# Altium schematic sheet DSP_2.SchDoc
size A; SheetNumber: 3; SheetTotal: 6
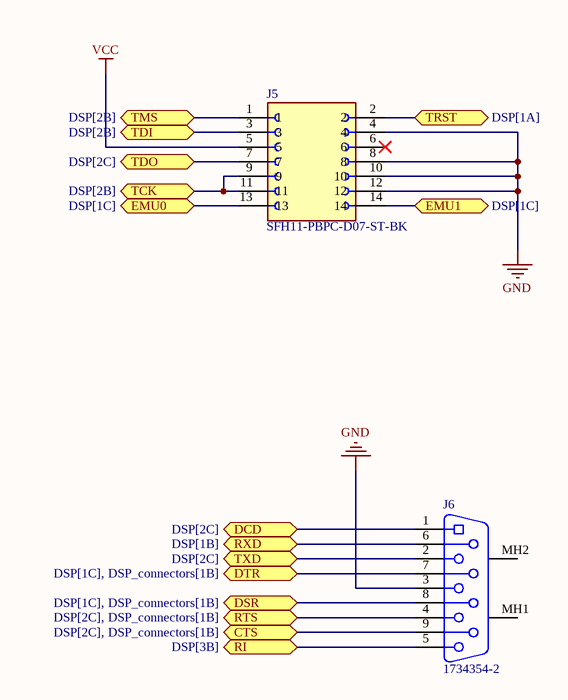
[diagram p0: DSP_2.SchDoc]

## Parts
J5  SFH11-PBPC-D07-ST-BK  [SULLINS_SFH11-PBPC-D07-ST-BK]
J6  1734354-2  [TECO-1734354-2_V]

## Ports
CTS (bidir, see DSP[2C], DSP_connectors[1B]), DCD (bidir, see DSP[2C]), DSR (bidir, see DSP[1C], DSP_connectors[1B]), DTR (bidir, see DSP[1C], DSP_connectors[1B]), EMU0 (bidir, see DSP[1C]), EMU1 (bidir, see DSP[1C]), RI (bidir, see DSP[3B]), RTS (bidir, see DSP[2C], DSP_connectors[1B]), RXD (bidir, see DSP[1B]), TCK (bidir, see DSP[2B]), TDI (bidir, see DSP[2B]), TDO (bidir, see DSP[2C]), TMS (bidir, see DSP[2B]), TRST (bidir, see DSP[1A]), TXD (bidir, see DSP[2C])

## Nets
GND: J5.4 J5.8 J5.10 J5.12 J6.3
VCC: J5.5
CTS: J6.9 ; port CTS
DCD: J6.1 ; port DCD
DSR: J6.8 ; port DSR
DTR: J6.7 ; port DTR
EMU0: J5.13 ; port EMU0
EMU1: J5.14 ; port EMU1
RI: J6.5 ; port RI
RTS: J6.4 ; port RTS
RXD: J6.6 ; port RXD
TCK: J5.9 J5.11 ; port TCK
TDI: J5.3 ; port TDI
TDO: J5.7 ; port TDO
TMS: J5.1 ; port TMS
TRST: J5.2 ; port TRST
TXD: J6.2 ; port TXD

Not connected (* = marked no-connect by the designer): J5 6*; J6 MH1 MH2

## Library data of the parts
J5 = SFH11-PBPC-D07-ST-BK: 14 Position Header Connector Through Hole; MF: Sullins Connector; Value: *; Check_prices: https://www.snapeda.com/parts/SFH11-PBPC-D07-ST-BK/Sullins%20Connector%20Solutions/view-part/851415/?ref=eda; Availability: Warning; Package: None; SnapEDA_Link: https://www.snapeda.com/parts/SFH11-PBPC-D07-ST-BK/Sullins%20Connector%20Solutions/view-part/851415/?ref=snap; Purchase-URL: https://pricing.snapeda.com/search/part/SFH11-PBPC-D07-ST-BK/?ref=eda; Price: None; MP: SFH11-PBPC-D07-ST-BK
J6 = CMP-2000-05500-1: Female D-Sub Connector, Pitch 2.77 mm, 9 Position, Height 12.75 mm, Tail Length 3.2 mm, -55 to 105 degC, RoHS, Tray; Manufacturer: TE Connectivity; Product Training Modules: AMPLIMITED-SubConnectors; Flange Feature: MatingSide;FemaleScrewlock(4-40); Connector Type: Receptacle,FemaleSockets; 3D Model: 1734354-2.pdf; Dynamic Catalog: AMPLIMITEHD-20Series; Featured Product: AMPLIMITED-SubminiatureConnectors; Number of Positions: 9; Other Names: A35108; Current Rating: 2A; Voltage Rating: 250V; Mating Products: AML09B-ND / -CONND-SUBPLUG9POSGOLD; Catalog Drawings: AMPD-SubMale.318; Housing Material: Polyamide(PA9T),Nylon9T,GlassFilled; Connector Style: D-Sub; Datasheet Version: Rev. A1, 03/2011; Category: Connectors,Interconnects; Shell Material, Finish: Steel,NickelPlated; Standard Package: 90; Color: Black; Contact Finish: Gold; Contact Type: Signal; Contact Finish Thickness: 15µin(0.38µm); Datasheet URL: http://www.te.com/commerce/DocumentDelivery/DDEController?Action=showdoc&DocId=Customer+Drawing%7F1734354%7FA1%7Fpdf%7FEnglish%7FENG_CD_1734354_A1.pdf%7F1734354-2; Mounting Type: ThroughHole,RightAngle; Features: BoardLock; RoHS Information: 1734354-2StatementofCompliance; Series: AMPLIMITEHD-20; Number of Rows: 2; Termination: Solder; Package Description: Female D-Sub Connector, Pitch 2.77 mm, 9 Position, Height 12.75 mm, Tail Length 3.2 mm; Mounting Technology: ThroughHole; Shell Size, Connector Layout: 1(DE,E); Family: D-SubConnectors; Manufacturer URL: http://www.te.com/; Operating Temperature: -55°C~105°C; Package Reference: 1734354-2